# EAGLE design BatteryProtection (EAGLE 6.4)

## Sheet 1 of 2
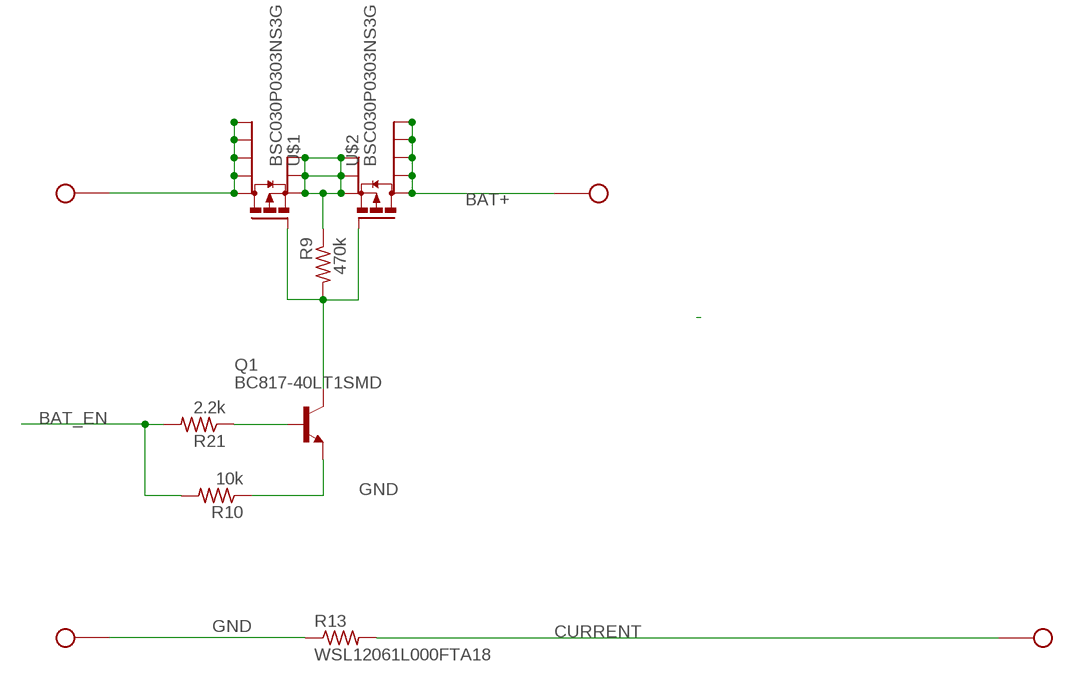
[diagram p0: schematic, sheet 1]

### Parts
Q1  BC817-40LT1SMD  [SOT23-BEC]
R9  470k  R-US_R0402  [R0402]
R10  10k  R-US_R0402  [R0402]
R13  WSL12061L000FTA18  R-US_R2512  [R2512]
R21  2.2k  R-US_R0402  [R0402]
U$1  BSC030P0303NS3G  [PG-TDSON-8]
U$2  BSC030P0303NS3G  [PG-TDSON-8]
X1  SOLDER_HOLE18AWG  [SOLDER_HOLE_18]
X2  SOLDER_HOLE18AWG  [SOLDER_HOLE_18]
X5  SOLDER_HOLE18AWG  [SOLDER_HOLE_18]
X13  SOLDER_HOLE18AWG  [SOLDER_HOLE_18]

### Nets
BAT+: U$2.5(D) U$2.6(D1) U$2.7(D2) U$2.8(D3) U$2.TH(D4) X1.1 ; also sheet 2
BAT_EN: R10.2 R21.2 ; also sheet 2
CURRENT: R13.2 X2.1 ; also sheet 2
GND: Q1.E R10.1 R13.1 X13.1 ; also sheet 2
N$1: R9.1 U$1.1(S) U$1.2(S1) U$1.3(S2) U$2.1(S) U$2.2(S1) U$2.3(S2)
N$9: Q1.B R21.1
N$11: Q1.C R9.2 U$1.4(G) U$2.4(G)
N$12: U$1.5(D) U$1.6(D1) U$1.7(D2) U$1.8(D3) U$1.TH(D4) X5.1

## Sheet 2 of 2
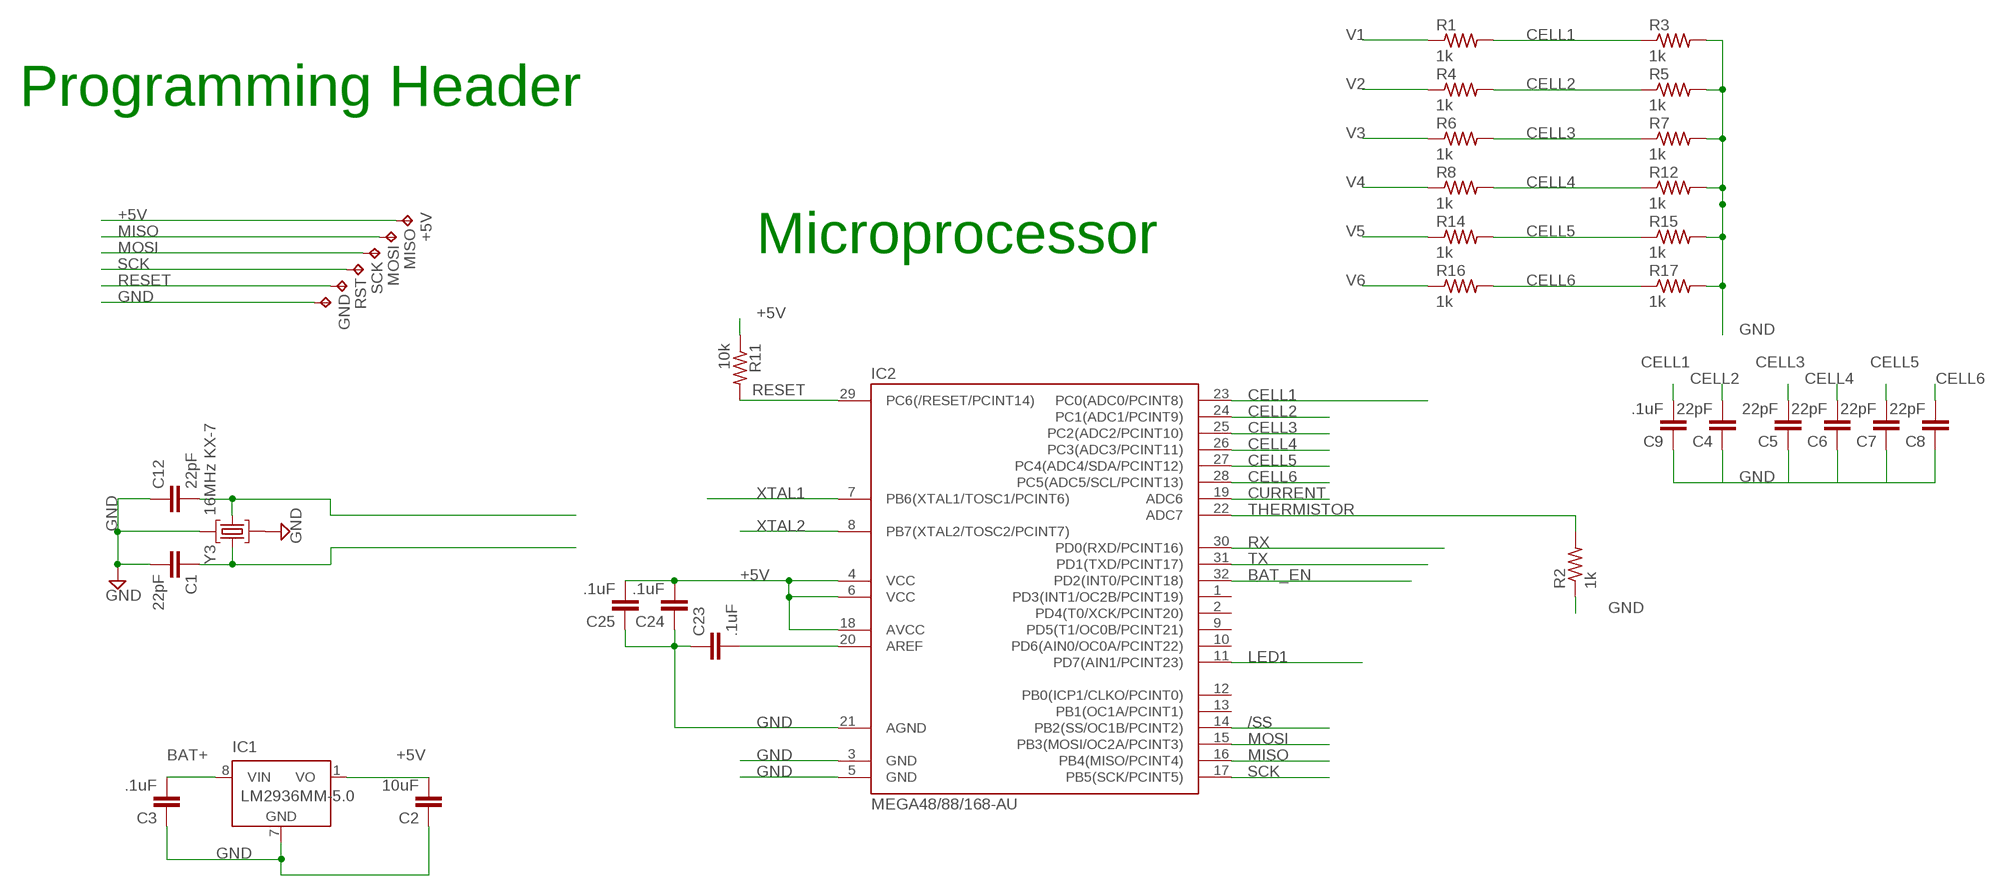
[diagram p1: schematic, sheet 2]

### Parts
+5V  TPTP08R  [TP08R]
C1  22pF  C-EUC0402  [C0402]
C2  10uF  C-EUC0805  [C0805]
C3  .1uF  C-EUC0402  [C0402]
C4  22pF  C-EUC0402  [C0402]
C5  22pF  C-EUC0402  [C0402]
C6  22pF  C-EUC0402  [C0402]
C7  22pF  C-EUC0402  [C0402]
C8  22pF  C-EUC0402  [C0402]
C9  .1uF  C-EUC0402  [C0402]
C12  22pF  C-EUC0402  [C0402]
C23  .1uF  C-EUC0402  [C0402]
C24  .1uF  C-EUC0402  [C0402]
C25  .1uF  C-EUC0402  [C0402]
GND  TPTP08R  [TP08R]
IC1  LM2936MM-5.0  [MINI-SO8]
IC2  MEGA48/88/168-AU  [TQFP32-08]
MISO  TPTP08R  [TP08R]
MOSI  TPTP08R  [TP08R]
R1  1k  R-US_R0402  [R0402]
R2  1k  R-US_R0402  [R0402]
R3  1k  R-US_R0402  [R0402]
R4  1k  R-US_R0402  [R0402]
R5  1k  R-US_R0402  [R0402]
R6  1k  R-US_R0402  [R0402]
R7  1k  R-US_R0402  [R0402]
R8  1k  R-US_R0402  [R0402]
R11  10k  R-US_R0402  [R0402]
R12  1k  R-US_R0402  [R0402]
R14  1k  R-US_R0402  [R0402]
R15  1k  R-US_R0402  [R0402]
R16  1k  R-US_R0402  [R0402]
R17  1k  R-US_R0402  [R0402]
RST  TPTP08R  [TP08R]
SCK  TPTP08R  [TP08R]
Y3  16MHz KX-7  CRYSTAL-3.2-2.5  [CRYSTAL-3.2-2.5]

### Nets
+5V: +5V.TP C2.2 C24.2 C25.2 IC1.1(VO) IC2.4(VCC) IC2.6(VCC) IC2.18(AVCC) R11.1
/SS: IC2.14(PB2(SS/OC1B/PCINT2))
BAT+: C3.2 IC1.8(VIN) ; also sheet 1
BAT_EN: IC2.32(PD2(INT0/PCINT18)) ; also sheet 1
CELL1: C9.2 IC2.23(PC0(ADC0/PCINT8)) R1.2 R3.1
CELL2: C4.2 IC2.24(PC1(ADC1/PCINT9)) R4.2 R5.1
CELL3: C5.2 IC2.25(PC2(ADC2/PCINT10)) R6.2 R7.1
CELL4: C6.2 IC2.26(PC3(ADC3/PCINT11)) R8.2 R12.1
CELL5: C7.2 IC2.27(PC4(ADC4/SDA/PCINT12)) R14.2 R15.1
CELL6: C8.2 IC2.28(PC5(ADC5/SCL/PCINT13)) R16.2 R17.1
CURRENT: IC2.19(ADC6) ; also sheet 1
GND: C1.2 C2.1 C3.1 C4.1 C5.1 C6.1 C7.1 C8.1 C9.1 C12.1 C23.1 C24.1 C25.1 GND.TP IC1.7(GND) IC2.3(GND) IC2.5(GND) IC2.21(AGND) R2.1 R3.2 R5.2 R7.2 R12.2 R15.2 R17.2 Y3.2(GND) Y3.4(GND) ; also sheet 1
LED1: IC2.11(PD7(AIN1/PCINT23))
MISO: IC2.16(PB4(MISO/PCINT4)) MISO.TP
MOSI: IC2.15(PB3(MOSI/OC2A/PCINT3)) MOSI.TP
N$36: C23.2 IC2.20(AREF)
RESET: IC2.29(PC6(/RESET/PCINT14)) R11.2 RST.TP
RX: IC2.30(PD0(RXD/PCINT16))
SCK: IC2.17(PB5(SCK/PCINT5)) SCK.TP
THERMISTOR: IC2.22(ADC7) R2.2
TX: IC2.31(PD1(TXD/PCINT17))
V1: R1.1
V2: R4.1
V3: R6.1
V4: R8.1
V5: R14.1
V6: R16.1
XTAL1: C1.1 IC2.7(PB6(XTAL1/TOSC1/PCINT6)) Y3.3(C2)
XTAL2: C12.2 IC2.8(PB7(XTAL2/TOSC2/PCINT7)) Y3.1(C1)
Unconnected: IC2.1(PD3(INT1/OC2B/PCINT19)) IC2.2(PD4(T0/XCK/PCINT20)) IC2.9(PD5(T1/OC0B/PCINT21)) IC2.10(PD6(AIN0/OC0A/PCINT22)) IC2.12(PB0(ICP1/CLKO/PCINT0)) IC2.13(PB1(OC1A/PCINT1))

### Notes on the sheet
- Programming Header
- Microprocessor

## Library data of the parts
+5V GND MISO MOSI RST SCK = testpad:TP: Test pad
C1-C3 C9 C23-C25 = rcl:C-EU: CAPACITOR, European symbol
C4-C8 C12 = SmartPrj:C-EU: CAPACITOR, European symbol
IC1 = national-semiconductor:LM2936?*: Ultra-Low Quiescent Current LDO Voltage Regulator Source: Data sheet <http://www.national.com/ds/LM/LM2936.pdf>; MF: NATIONAL SEMICONDUCTOR; MPN: LM2936MM-5.0/NOPB; OC_FARNELL: 1312707; OC_NEWARK: 41K4518
IC2 = avr-5:MEGA48/88/168
Q1 = transistor-npn:BC817*: NPN Transistor
R1-R8 R11 R12 R14-R17 = rcl:R-US_: RESISTOR, American symbol
R9 R10 R13 R21 = ForBattery:R-US_: RESISTOR, American symbol
U$1 U$2 = transistor-power:BSC030P0303NS3G
X1 X2 X5 X13 = ForBattery:SOLDER_HOLE
Y3 = SmartPrj:CRYSTAL-3.2-2.5

## Board
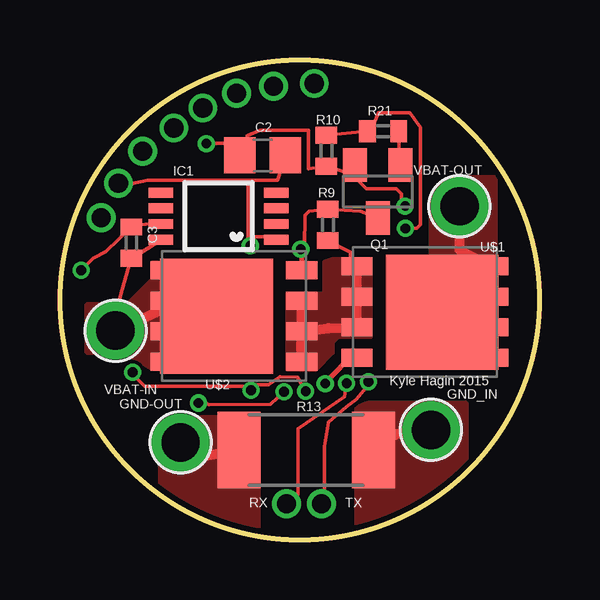
[diagram p2: board, top side]
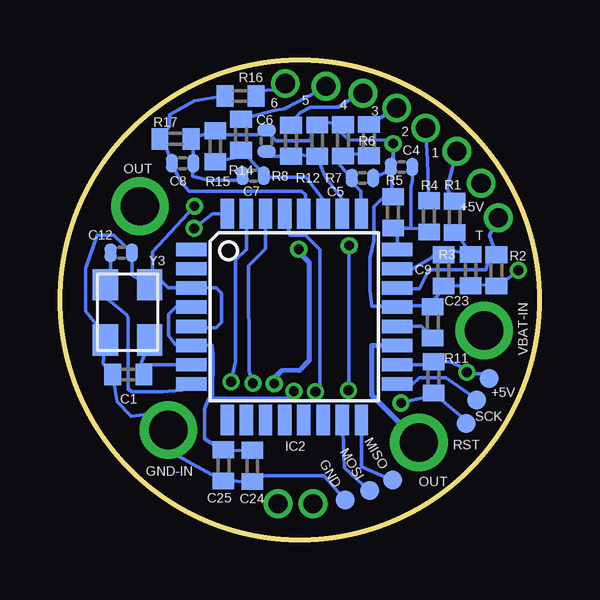
[diagram p3: board, bottom side, seen from below]

Size 20 x 20 mm. Coordinates in mm from the lower left corner, seen from the top.
Outline: circle at 10,10 radius 10
Copper layers (1*16): Top 0.035mm / dielectric 1.5mm / Bottom 0.035mm
Design rules "default *": minimum track width 6mil, minimum drill 16mil, track to track 6mil, track to pad 6mil, pad to pad 6mil, via to via 6mil, smd to smd 6mil, copper to edge 10mil, drill to drill 8mil, minimum pad ring 6mil, minimum via ring 6mil, stop-mask expansion 4mil, vias tented up to drill 15mil, thermal gap 10mil

### Footprints (pad centres in the part's own frame; a part is rotated, then mirrored left to right if it is on the bottom)
TP08R = smd 0.8 x 0.8: TP 0,0
C0402 = smd 0.7 x 0.9: 1 -0.65,0; 2 0.65,0
C0805 = smd 1.3 x 1.5: 1 -0.95,0; 2 0.95,0
C0402' = smd 0.508 x 0.762: 1 -0.445,0; 2 0.445,0
MINI-SO8 = smd 0.41 x 1.02: 1 -0.975,-2.4; 2 -0.325,-2.4; 3 0.325,-2.4; 4 0.975,-2.4; 5 0.975,2.4; 6 0.325,2.4; 7 -0.325,2.4; 8 -0.975,2.4
TQFP32-08 = smd 1.27 x 0.559: 1 -4.293,2.8; 2 -4.293,2; 3 -4.293,1.2; 4 -4.293,0.4; 5 -4.293,-0.4; 6 -4.293,-1.2; 7 -4.293,-2; 8 -4.293,-2.8; 17 4.293,-2.8; 18 4.293,-2; 19 4.293,-1.2; 20 4.293,-0.4; 21 4.293,0.4; 22 4.293,1.2; 23 4.293,2; 24 4.293,2.8 | smd 0.559 x 1.27: 9 -2.8,-4.293; 10 -2,-4.293; 11 -1.2,-4.293; 12 -0.4,-4.293; 13 0.4,-4.293; 14 1.2,-4.293; 15 2,-4.293; 16 2.8,-4.293; 25 2.8,4.293; 26 2,4.293; 27 1.2,4.293; 28 0.4,4.293; 29 -0.4,4.293; 30 -1.2,4.293; 31 -2,4.293; 32 -2.8,4.293
SOT23-BEC = smd 1 x 1.4: B -0.95,-1.1; C 0,1.1; E 0.95,-1.1
R0402 = smd 0.7 x 0.9: 1 -0.65,0; 2 0.65,0
R2512 = smd 1.8 x 3.2: 1 -2.8,0; 2 2.8,0
PG-TDSON-8 = smd 1.3 x 0.75: 1 -2.825,1.905; 2 -2.825,0.635; 3 -2.825,-0.635; 4 -2.825,-1.905; 5 2.825,-1.905; 6 2.825,-0.635; 7 2.825,0.635; 8 2.825,1.905 | smd 4.7 x 4.8: TH 0.725,0
SOLDER_HOLE_18 = drill 1.6: 1 0,0
CRYSTAL-3.2-2.5 = smd 1.3 x 1.05: 1 -1.15,-0.925; 2 1.15,-0.925; 3 1.15,0.925; 4 -1.15,0.925

### Placement (x,y rotation side)
+5V  2.11,6.74 0 bottom
C1  17.15,6.89 180 bottom
C2  8.45,16.02 0 top
C3  2.98,12.39 270 top
C4  22pF  [C0402']  5.75,15.54 0 bottom
C5  22pF  [C0402']  7.38,15.08 180 bottom
C6  22pF  [C0402']  11.38,16.63 270 bottom
C7  22pF  [C0402']  11.94,15.18 0 bottom
C8  22pF  [C0402']  14.88,15.7 180 bottom
C9  4.01,11.23 90 bottom
C12  22pF  [C0402']  17.44,11.96 180 bottom
C23  4.45,9.07 270 bottom
C24  11.98,3.08 90 bottom
C25  13.18,3.11 90 bottom
GND  8.1,1.66 0 bottom
IC1  6.61,13.49 90 top
IC2  10.23,9.3 0 bottom
MISO  6.13,2.5 0 bottom
MOSI  7.08,2.06 0 bottom
Q1  13.25,14.52 180 top
R1  3.54,13.46 270 bottom
R2  1.8,11.24 90 bottom
R3  2.87,11.25 270 bottom
R4  4.61,13.48 270 bottom
R5  6.11,13.65 90 bottom
R6  7.12,16.66 270 bottom
R7  8.2,16.65 90 bottom
R8  10.36,16.64 270 bottom
R9  11.17,13.13 90 top
R10  11.11,16.22 90 top
R11  4.42,6.77 270 bottom
R12  9.27,16.64 90 bottom
R13  10.27,3.75 180 top
R14  12.45,16.88 270 bottom
R15  13.52,16.4 90 bottom
R16  12.47,18.5 180 bottom
R17  15.18,16.71 0 bottom
R21  13.48,17.03 180 top
RST  3.06,4.85 0 bottom
SCK  2.62,5.84 0 bottom
U$1  15.22,9.5 0 top
U$2  7.26,9.33 180 top
X1  2.31,8.73 270 top
X2  5.03,4.07 0 top
X5  16.66,13.91 270 top
X13  15.47,4.59 0 top
Y3  17.18,9.49 270 bottom

### Tracks (layer width: path | path; a pad name or v marks a point on that pad's centre or on a via)
+5V  (via drill 0.41, 0.8)
  Top 0.152: C2.2 9.07,14.98 7.83,14.98 | IC1.1 8.74,12.64 7.93,12.64 v7.94,12.27 7.83,12.37 7.83,14.98 | v10.25,6.2 9.91,6.79 9.19,6.8 8.7,6.47 8.2,6.47 v7.97,6.24 | v7.97,6.24 8,6.4 | v3.03,6.99 3.09,6.85 3.54,6.4 7.81,6.4 v7.97,6.24 | 7.83,14.98 3.65,14.98 2.97,14.84
  Top 0.203: 2.97,14.84 2.46,14.84 v2.44,14.86
  Bottom 0.152: IC2.18 4.34,7.3 R11.1 3.82,7.43 3.69,7.41 3.09,7.13 v3.03,6.99 2.95,6.93 2.3,6.93 +5V.TP | 13.64,5.9 13.67,5.93 13.74,5.84 13.81,5.88 13.96,5.48 13.96,4.21 13.05,3.63 13.09,3.75 C25.2 12.33,3.72 C24.2 | 13.64,5.9 13.62,7.71 13.65,8.11 14.5,8.12 | 14.5,8.12 IC2.6 | 14.5,8.12 15.19,8.16 15.46,8.5 15.46,9.41 15.16,9.73 14.55,9.73 IC2.4 | v10.25,6.2 10.32,6.22 10.47,5.9 12.81,5.9 13.64,5.9 | 8.01,6.51 v7.97,6.24 7.94,6.27 v7.94,12.27
BAT+
  Top 0.152: X1.1 2.15,8.89 C3.2 2.95,11.68 3.01,11.82 3.34,11.94 IC1.8
  Top 0.406: X1.1 4.51,9.72 | 4.51,9.72 U$2.6 U$2.5 | 4.51,9.72 4.51,8.6 U$2.7 | U$2.7 U$2.8 | U$2.7 6.05,8.52 U$2.TH
  pour Top (no thermals): 3.84,7.14 2.73,7.81 1.14,7.81 1.14,9.82 2.84,9.82 3.86,10.84 3.86,11.55 8.58,11.55 8.58,7.13 4.3,7.13
BAT_EN  (via drill 0.41)
  Top 0.152: R10.2 12.56,17.01 R21.2 13.09,16.65 13.09,17.35 13.27,17.8 14.59,17.8 15.04,17.2 15.04,13.14 14.88,12.98 v14.41,12.98
  Bottom 0.152: IC2.32 13.63,13.59 v14.41,12.98
CELL1
  Bottom 0.152: IC2.23 5.31,11.3 4.52,11.73 | 4.42,11.84 3.75,12.07 R3.1 3.68,13.1 R1.2 | 4.52,11.73 4.42,11.84 | 4.46,11.78 4.52,11.73 | 4.42,11.84 C9.2
CELL2
  Bottom 0.152: IC2.24 5.93,13.08 R5.1 5.37,12.99 | 5.37,12.99 4.85,12.98 R4.2 | C4.2 5.31,14.99 5.37,14.7 5.37,13.18 5.37,12.99
CELL3
  Bottom 0.152: R7.1 8.33,16.17 | 8.33,16.17 R6.2 | 8.33,16.17 8.33,15.62 C5.2 8.03,15.1 7.45,14.52 7.45,13.62 IC2.25
CELL4
  Bottom 0.152: IC2.26 8.23,14.2 8.87,15.03 9.03,15.34 R12.1 10.42,16.07 R8.2 11.25,15.99 C6.2
CELL5
  Bottom 0.152: IC2.27 9.03,14.2 9.75,15.12 11.19,15.12 11.57,15.26 | R15.1 12.32,16 R14.2 11.57,15.35 11.57,15.26 | 11.57,15.26 11.53,15.26 C7.2
CELL6
  Bottom 0.152: IC2.28 9.77,13.65 9.77,14.38 9.93,14.53 14.62,14.53 14.99,14.97 15.32,15.69 C8.2 15.65,16.57 R17.1 15.44,17.25 15.44,17.71 14.39,18.3 R16.2
CURRENT
  Top 0.406: R13.2 5.67,3.44 X2.1
  Bottom 0.203: IC2.19 7.01,8.1 7.01,6.04 5.64,4.67 5.63,4.67 X2.1
  pour Top (no thermals): 4.18,3.33 4.18,-1.85 8.28,-1.85 8.28,5.1 4.64,5.1 4.22,3.81
GND  (via drill 0.41)
  Top 0.152: IC1.7 3.57,13.16 3.07,13.1 2.76,12.78 C3.1 1.91,12.01 1.39,11.73 v0.89,11.24 | 12.67,3.82 R13.1 | 7.8,16.52 7.8,16.84 8.35,17.08 10.36,17.08 10.36,15.48 R10.1 12.25,15.22 Q1.E 12.41,15.48 12.41,15.01 12.79,14.63 14.02,14.63 14.24,14.42 14.24,14.07 v14.39,13.91 | 7.8,16.52 C2.1 | 7.8,16.52 6.33,16.52 v6.11,16.52
  Top 0.406: X13.1 14.02,4.41 R13.1
  Bottom 0.152: 14.24,13.9 v14.39,13.91 16.13,12 16.13,11.14 | 16.13,11.14 Y3.4 17,11.04 C12.1 17.76,12.69 18.45,12.69 18.93,11.33 18.93,9.53 18.19,8.64 Y3.2 18.19,7.34 C1.2 17.62,5.76 17.02,5.16 16.49,5.23 X13.1 15.23,3.97 15.23,3.6 13.14,2.43 C25.1 12.04,2.43 C24.1 11.97,2.42 11.86,2.67 8.99,2.67 GND.TP 8.11,1.73 | IC2.5 14.47,8.85 13.49,8.85 13.26,9.07 13.26,10.27 13.49,10.5 IC2.3 15.5,10.5 16.13,11.14 | R5.2 6.22,14.55 | 6.22,14.55 6.9,13.89 6.9,12.47 7.07,11.76 7.07,10.39 6.99,9.73 5.97,9.73 IC2.21 5.88,9.75 4.78,9.76 4.72,9.95 C23.1 4.52,9.78 C9.1 3.6,10.6 R3.2 3.2,10.68 R2.1 1.59,10.68 v0.89,11.24 | 6.22,14.55 6.17,14.57 6.16,15.65 | 6.16,15.65 6.13,15.89 | 6.13,15.89 6.09,15.91 6.08,16.66 7.96,16.68 8.39,17.07 R7.2 9.16,17.45 R12.2 9.5,17.3 9.5,16.76 9.62,16.64 10.98,16.64 11.37,17.03 C6.1 11.47,17.03 11.76,16.89 13.33,16.89 13.38,16.79 13.38,17.29 R15.2 13.66,17.02 R17.2 14.44,16.93 C8.1 14.47,15.67 14.47,15.15 13.8,14.99 12.58,14.99 C7.1 | v6.11,16.52 6.11,15.87 6.13,15.89 | C5.1 6.42,15.32 C4.1 6.2,15.56 6.16,15.65
  pour Top (no thermals): 12.36,5.49 12.36,0.7 16.94,0.7 16.94,5.69 12.86,5.69
MISO
  Bottom 0.152: IC2.16 7.43,3.05 MISO.TP
MOSI
  Bottom 0.152: IC2.15 8.14,3.01 MOSI.TP
N$1
  Top 0.152: R9.1 11.28,12.4 12.11,12 12.11,11.44 U$1.1
  Top 0.406: U$1.1 U$1.2 U$1.3 11.21,8.83 U$2.2 | U$2.1 U$2.2 | U$2.3 U$2.2
  pour Top (no thermals): 11.03,11.57 11.03,10.24 9.49,10.25 9.49,7.12 10.67,7.12 11.37,7.82 11.37,8.26 11.6,8.49 12.95,8.49 12.95,11.68 11.37,11.68
N$9
  Top 0.152: R21.1 14.12,15.33 Q1.B
N$11  (via drill 0.41)
  Top 0.152: Q1.C 12.52,13.7 R9.2 10.38,13.7 10.21,13.53 10.2,12.19 v10.04,12.11
  Top 0.203: U$2.4 10.11,11.56 v10.04,12.11 | v11.06,6.52 11.91,7.41 U$1.4
  Bottom 0.203: v10.04,12.11 10.04,12 9.6,11.56 9.6,7.48 10.01,7.08 10.02,7.07 10.76,7.04 11.15,6.66 v11.06,6.52
N$12
  Top 0.406: X5.1 16.66,12.08 U$1.8 U$1.7 | U$1.7 16.22,9.79 U$1.TH | U$1.7 U$1.6 U$1.5
  pour Top (no thermals): 15.75,14.72 15.48,13.9 15.48,11.76 13.67,11.76 13.67,7.22 18.16,7.22 18.16,15.09 16.34,15.09
N$36
  Bottom 0.152: IC2.20 4.93,8.9 C23.2
RESET  (via drill 0.41)
  Top 0.152: v9.35,6.18 8.78,5.65 6.21,5.64 6.05,5.71 v5.77,5.71
  Bottom 0.152: RST.TP 3.06,4.98 R11.2 4.38,6.13 4.16,6.12 4.68,5.97 v5.77,5.71 | IC2.29 10.42,12.71 9.77,12.71 9.15,12.1 9.15,6.37 v9.35,6.18 9.15,6.29
RX  (via drill 0.41, 0.8)
  Top 0.152: v11.96,6.53 11.87,5.96 9.92,4.63 9.92,1.89 v9.44,1.51
  Bottom 0.152: IC2.30 11.43,12.14 12.13,11.43 12.11,7.04 v11.96,6.53
SCK
  Bottom 0.152: SCK.TP 2.62,5.87 3.91,6.77 5.01,6.77 5.32,6.46 5.9,6.46 IC2.17
THERMISTOR  (via drill 0.8)
  Bottom 0.152: v1.72,13.43 2.09,12.71 R2.2 2.02,12.04 2.25,11.26 4.61,11.25 5.01,10.47 5.33,10.47 5.92,10.49 IC2.22
TX  (via drill 0.41, 0.8)
  Top 0.152: v12.86,6.59 12.95,6.57 12.37,5.87 11.94,5.55 11.2,4.91 11.03,3.92 11.04,3.76 11.04,1.53 v10.9,1.51
  Bottom 0.152: IC2.31 12.23,12.12 12.67,11.68 12.67,7.46 v12.86,6.59
V1  (via drill 0.8)
  Bottom 0.152: v3.45,16.19 3.86,14.66 R1.1
V2  (via drill 0.8)
  Bottom 0.152: v4.75,17.17 4.67,15.85 R4.1
V3  (via drill 0.8)
  Bottom 0.152: R6.1 6.27,17.82 v5.96,18
V4  (via drill 0.8)
  Bottom 0.152: v7.37,18.62 7.99,18.3 8.4,18.03 9.55,18.03 9.99,17.79 10.42,17.31 R8.1
V5  (via drill 0.8)
  Bottom 0.152: v8.91,18.9 9.29,18.69 10.63,17.98 11.03,17.92 R14.1
V6  (via drill 0.8)
  Bottom 0.152: v10.6,19.02 10.83,18.81 11.13,18.76 12.14,18.68 12.06,18.63 11.72,18.58 R16.1
XTAL1
  Bottom 0.152: Y3.3 16.62,7.35 | 16.62,7.35 16.62,6.97 C1.1 | IC2.7 16.57,7.3 16.62,7.35
XTAL2
  Bottom 0.152: IC2.8 14.94,6.23 15.72,6.18 17,6.18 17.15,6.27 17.15,9.25 17.22,9.39 18.47,10.41 Y3.1 17.89,11.24 C12.2

### Text on the board
tNames: VBAT-OUT | Kyle Hagin 2015 | VBAT-IN | GND-OUT | GND_IN | RX | TX
bNames: 3 | 4 | 5 | 6 | 2 | 1 | OUT | +5V | T | VBAT-IN | OUT | GND-IN